# Altium schematic sheet Actuators_Interface.SchDoc
size A4; SheetNumber: 6; SheetTotal: 9
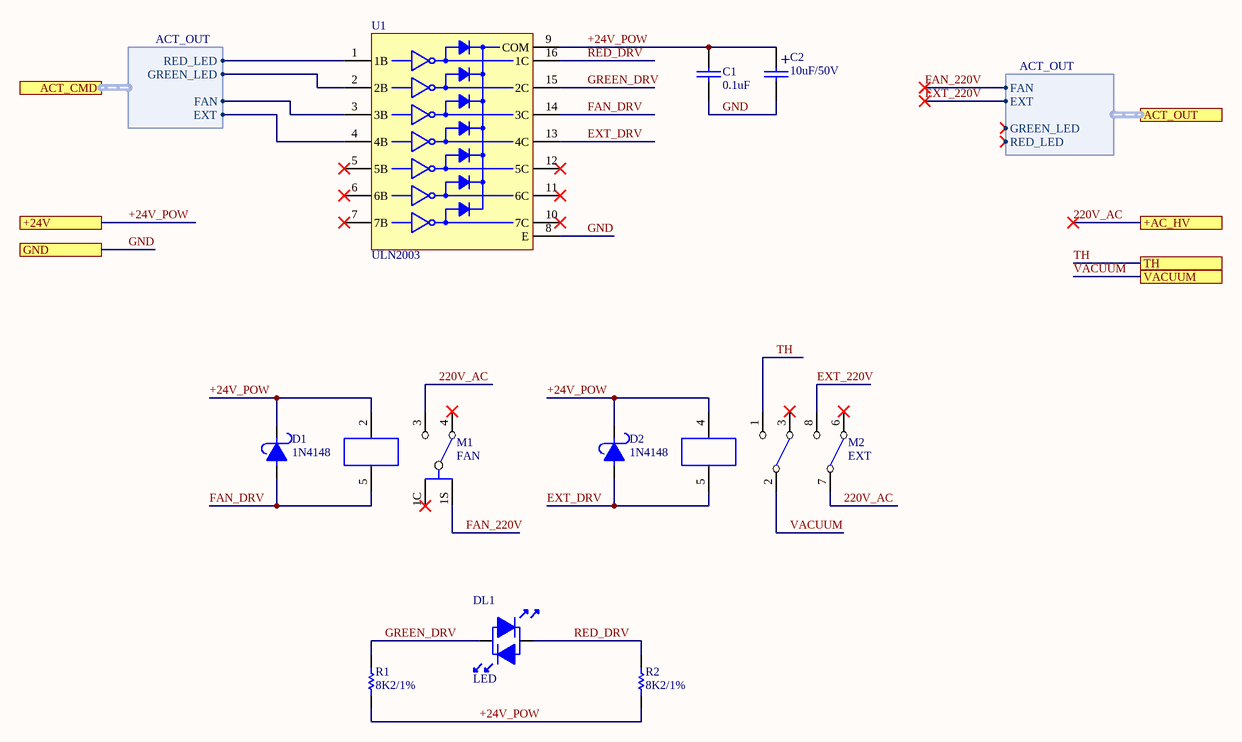
[diagram p0: Actuators_Interface.SchDoc]

## Parts
C1  0.1uF  [1206-CAP-TDK]
C2  10uF/50V  [CAP100RP]
D1  1N4148  [DO41]
D2  1N4148  [DO41]
DL1  LED  [LED-5MM - BI]
M1  FAN  [HJQ-15F-FORM-C]
M2  EXT  [TRA3-2-FORM-C]
R1  8K2/1%  [RES400]
R2  8K2/1%  [RES400]
U1  ULN2003  [DIP16]

## Ports
+24V, +AC_HV, ACT_CMD (harness ACT_OUT), ACT_OUT (harness ACT_OUT), GND, TH, VACUUM

## Harnesses
ACT_OUT: EXT, FAN, GREEN_LED, RED_LED

## Nets
220V_AC: M1.3(NA1) M2.7(C2) ; port +AC_HV
+24V_POW: C1.2 C2.1 D1.2 D2.2 M1.2(B1) M2.4(B1) R1.1 R2.1 U1.9(COM) ; port +24V
EXT_220V: M2.8(NA2) ; port ACT_OUT.EXT
EXT_DRV: D2.1 M2.5(B2) U1.13(4C)
FAN_220V: M1.1S(C1) ; port ACT_OUT.FAN
FAN_DRV: D1.1 M1.5(B2) U1.14(3C)
GND: C1.1 C2.2 U1.8(E) ; port GND
GREEN_DRV: DL1.1 R1.2 U1.15(2C)
RED_DRV: DL1.2 R2.2 U1.16(1C)
TH: M2.1(NA1) ; port TH
VACUUM: M2.2(C1) ; port VACUUM
NetU1_1: U1.1(1B) ; port ACT_CMD.RED_LED
NetU1_2: U1.2(2B) ; port ACT_CMD.GREEN_LED
NetU1_3: U1.3(3B) ; port ACT_CMD.FAN
NetU1_4: U1.4(4B) ; port ACT_CMD.EXT

Not connected (* = marked no-connect by the designer): M1 1C(C1)* 4(NC1)*; M2 3(NC1)* 6(NC2)*; U1 5(5B)* 6(6B)* 7(7B)* 10(7C)* 11(6C)* 12(5C)*

## Notes on the sheet
- (in symbol CAPPOL-THT) +

## Library data of the parts
C1 = CAP-SMD: JLCPart: C24497
C2 = CAPPOL-THT: JLCPart: C2960372
D1 D2 = DIODE SCHOTTKY: JLCPart: C258182
DL1 = LED-BI
M1 = RELE SIMPLE M
M2 = RELE DOBLE
R1 R2 = RES-THT: JLCPart: C337170
U1 = ULN2003: JLCPart: C93000